# EAGLE design timerShield_r1 (EAGLE 9.6.2)
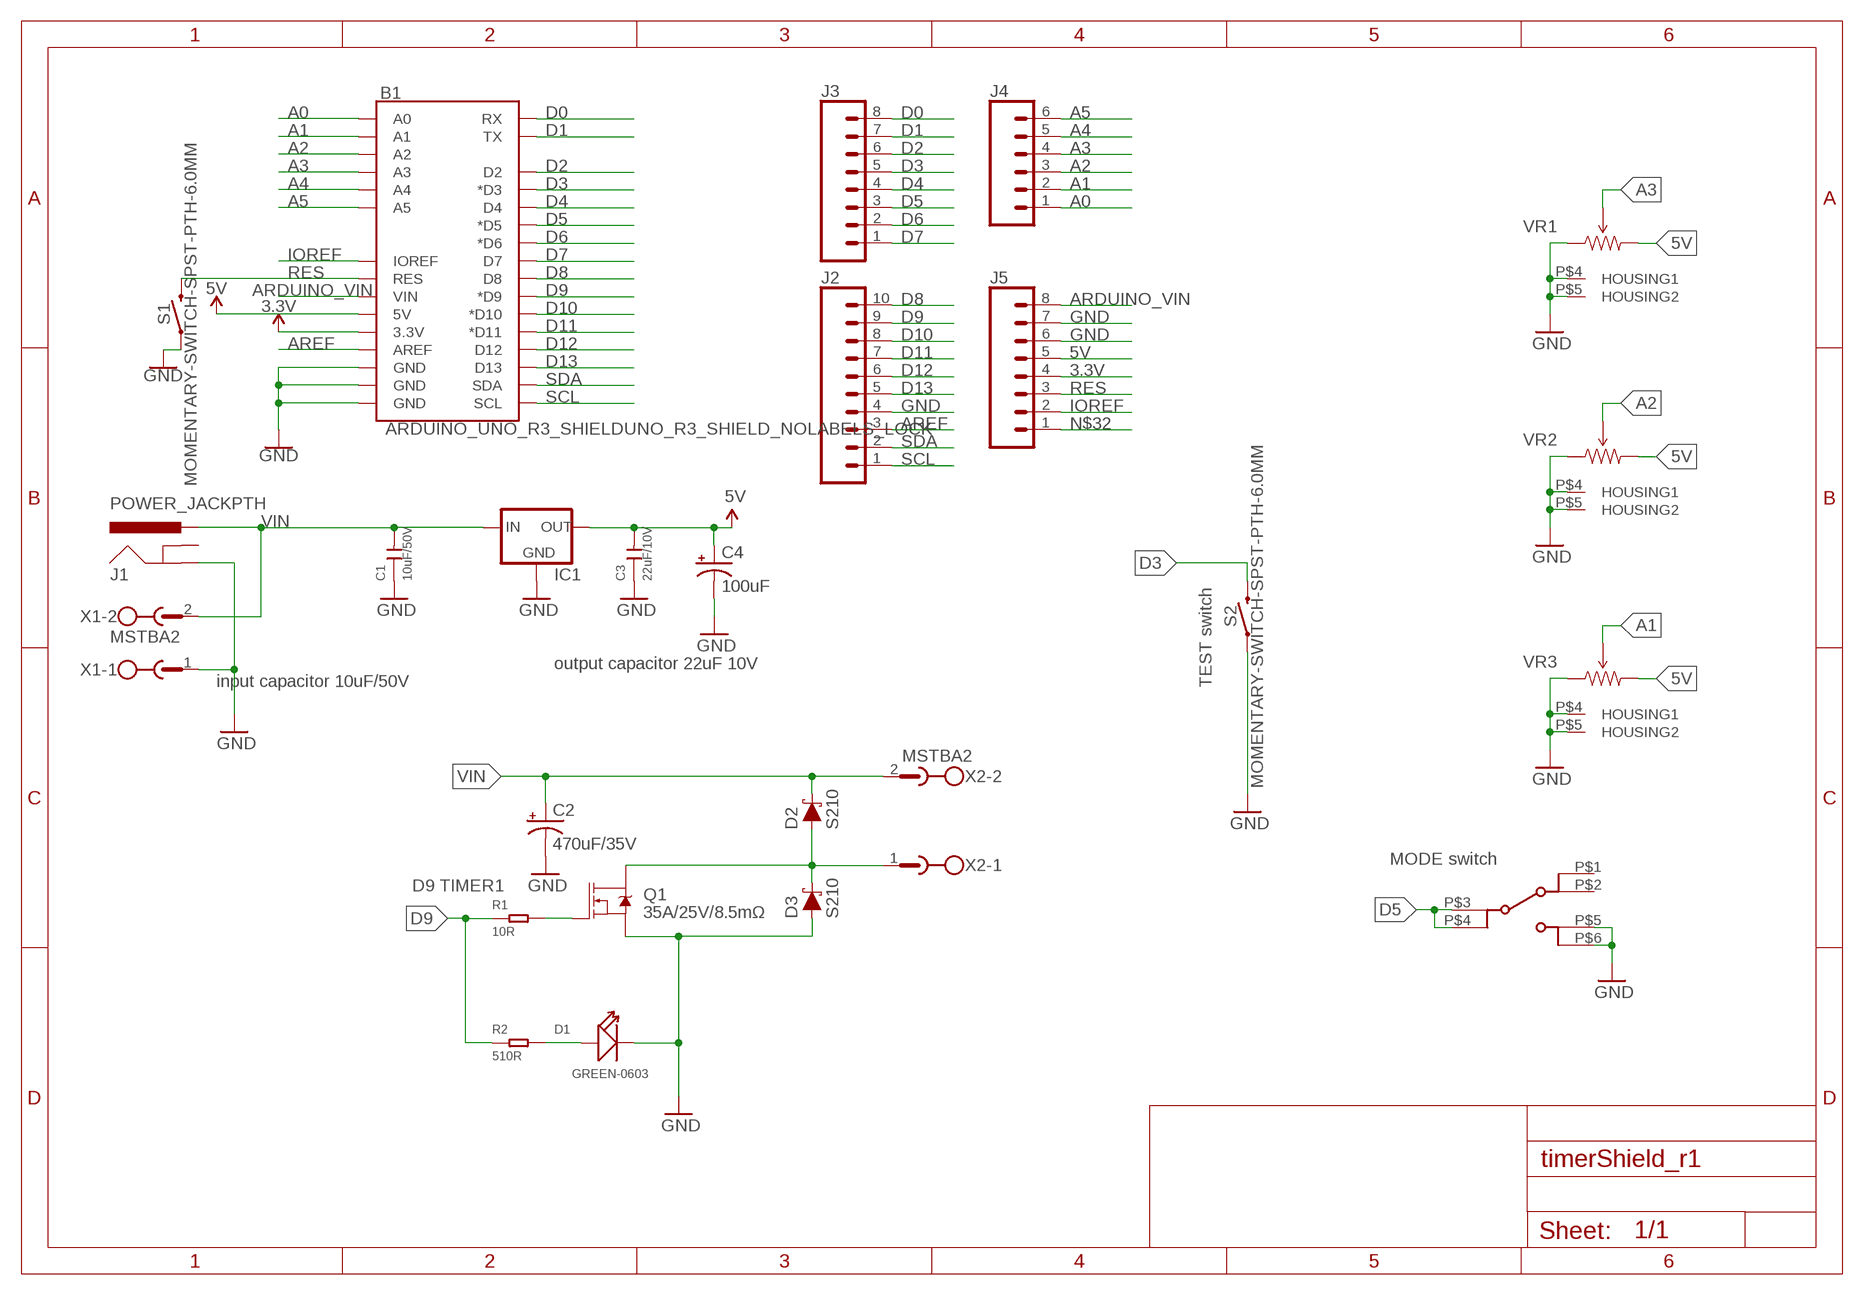
[diagram p0: schematic, sheet 1]

## Parts
B1  ARDUINO_UNO_R3_SHIELDUNO_R3_SHIELD_NOLABELS_LOCK  [UNO_R3_SHIELD_NOLABELS_LOCK]
C1  10uF/50V  CERAMIC-10UF-25V-10%-X5R(1206)  [C1206]
C2  470uF/35V  1000UF-RADIAL-5MM-35V-20%-KIT  [CPOL-RADIAL-5MM-10MM-KIT]
C3  22uF/10V  CERAMIC-22UF-6.3V-20%-X5R(0805)  [C0805]
C4  100uF  100UF-POLAR-RADIAL-2.5MM-25V-20%  [CPOL-RADIAL-2.5MM-6.5MM]
D1  GREEN-0603  SMD-LED-CLEAR-GREEN(0603)  [LED-0603]
D2  S210  DIODE-SCHOTTKY-B340A  [SMA-DIODE]
D3  S210  DIODE-SCHOTTKY-B340A  [SMA-DIODE]
IC1  V_REG_78XX_K78XX-500R3  [K78XX-500R3]
J1  POWER_JACKPTH  [POWER_JACK_PTH]
J2  CONN_10"  [1X10]
J3  CONN_08"  [1X08]
J4  CONN_06SILK_FEMALE_PTH  [1X06]
J5  CONN_08"  [1X08]
MODE  SW_SSSS213202NARROW  [SW-SSSS213202NARROW]
Q1  35A/25V/8.5mΩ  MOSFET-NCH-FDD8780  [DPAK]
R1  10R  SMD-RES-10R-5%-1/10W(0603)  [R0603]
R2  510R  SMD-RES-510R-5%-1/10W(0603)  [R0603]
S1  MOMENTARY-SWITCH-SPST-PTH-6.0MM  [TACTILE_SWITCH_PTH_6.0MM]
S2  MOMENTARY-SWITCH-SPST-PTH-6.0MM  [TACTILE_SWITCH_PTH_6.0MM]
VR1  TRIMVR_HOUSING_RK09  [RK09]
VR2  TRIMVR_HOUSING_RK09  [RK09]
VR3  TRIMVR_HOUSING_RK09  [RK09]
X1  MSTBA2  [MSTBA2]
X2  MSTBA2  [MSTBA2]

## Nets
3.3V: B1.3.3V J5.4
5V: B1.5V C3.2 C4.1(+) IC1.3(OUT) J5.5 VR1.3(CW) VR2.3(CW) VR3.3(CW)
A0: B1.A0 J4.1
A1: B1.A1 J4.2 VR3.2(WIPER)
A2: B1.A2 J4.3 VR2.2(WIPER)
A3: B1.A3 J4.4 VR1.2(WIPER)
A4: B1.A4 J4.5
A5: B1.A5 J4.6
ARDUINO_VIN: B1.VIN J5.8
AREF: B1.AREF J2.3
D0: B1.RX J3.8
D1: B1.TX J3.7
D2: B1.D2 J3.6
D3: B1.D3(*D3) J3.5 S2.3
D4: B1.D4 J3.4
D5: B1.D5(*D5) J3.3 MODE.P$3(2-1) MODE.P$4(2-2)
D6: B1.D6(*D6) J3.2
D7: B1.D7 J3.1
D8: B1.D8 J2.10
D9: B1.D9(*D9) J2.9 R1.1 R2.1
D10: B1.D10(*D10) J2.8
D11: B1.D11(*D11) J2.7
D12: B1.D12 J2.6
D13: B1.D13 J2.5
GND: B1.GND@0(GND) B1.GND@1(GND) B1.GND@2(GND) C1.1 C2.- C3.1 C4.2(-) D1.- D3.A IC1.2(GND) J1.GND J2.4 J5.6 J5.7 MODE.P$5(3-1) MODE.P$6(3-2) Q1.3(S) S1.1 S2.1 VR1.1(CCW) VR1.P$4(HOUSING1) VR1.P$5(HOUSING2) VR2.1(CCW) VR2.P$4(HOUSING1) VR2.P$5(HOUSING2) VR3.1(CCW) VR3.P$4(HOUSING1) VR3.P$5(HOUSING2) X1.1
IOREF: B1.IOREF J5.2
N$1: Q1.1(G) R1.2
N$2: D1.+ R2.2
N$4: D2.A D3.C Q1.4(D) X2.1
N$32: J5.1
RES: B1.RES J5.3 S1.3
SCL: B1.SCL J2.1
SDA: B1.SDA J2.2
VIN: C1.2 C2.+ D2.C IC1.1(IN) J1.PWR X1.2 X2.2
Unconnected: J1.GNDBREAK MODE.P$1(1-1) MODE.P$2(1-2)

## Notes on the sheet
- output capacitor 22uF 10V
- input capacitor 10uF/50V | TEST switch
- MODE switch
- D9 TIMER1

## Library data of the parts
B1 = SparkFun-Boards:ARDUINO_UNO_R3_SHIELD: Arduino R3 Shield Footprint Shield form compatible with the Arduino Uno R3. SparkFun Products: MG2639 Cellular Shield <https://www.sparkfun.com/products/13120> MIDI Shield <https://www.sparkfun.com/products/12898> R3 Stackable Headers Kit <https://www.sparkfun.com/products/11417>
C1 = Seeed-Capacitor:CERAMIC-10UF-25V-10%-X5R(1206): 302010181; MPN: CC1206KKX5R8BB106; VALUE: 10uf
C2 = SparkFun-Capacitors:1000UF: 1,000µF/1mF ceramic capacitors A capacitor is a passive two-terminal electrical component used to store electrical energy temporarily in an electric field. CAP-08070; PROD_ID: CAP-09538; VALUE: 1mf
C3 = Seeed-Capacitor:CERAMIC-22UF-6.3V-20%-X5R(0805): 302010171; MPN: CC0805MKX5R5BB226; VALUE: 22uf
C4 = SparkFun-Capacitors:100UF-POLAR: 100µF polarized capacitors A capacitor is a passive two-terminal electrical component used to store electrical energy temporarily in an electric field.; PROD_ID: CAP-08439
D1 = Seeed-LED:SMD-LED-CLEAR-GREEN(0603): 304090043; MPN: 19-217-G7C-AN1P2-3T
D2 D3 = SparkFun-DiscreteSemi:DIODE-SCHOTTKY: Schottky diode A Schottky diode is a semiconductor diode which has a low forward voltage drop and a very fast switching action.; PROD_ID: DIO-09886; VALUE: 3A/40V/500mV
IC1 = _kantaParts:V_REG_78XX: Voltage Regulator Standard 7805 5V regulator. IGO (Input Ground Output). Spark Fun Electronics SKU : COM-00107 V7805-1000 <http://akizukidenshi.com/catalog/g/gM-06350/>
J1 = SparkFun-Connectors:POWER_JACK: Power Jack This is the standard 5.5mm barrel jack for power. The PTH is the most common, proven, reliable, footprint. The Slot footprint only works if the mill layer is transmitted to the PCB fab house so be warned. Mating wall wart : TOL-00298 (and others); PROD_ID: CONN-08197
J2 = SparkFun-Connectors:CONN_10: Multi connection point. Often used as Generic Header-pin footprint for 0.1 inch spaced/style header connections On any of the 0.1 inch spaced packages, you can populate with these: Break Away Headers - Straight <https://www.sparkfun.com/products/116> (PRT-00116) Break Away Male Headers - Right Angle <https://www.sparkfun.com/products/553> (PRT-00553) Female Headers <https://www.sparkfun.com/products/115> (PRT-00115) Break Away Headers - Machine Pin <https://www.sparkfun.com/products/117> (PRT-00117) Break Away Female Headers - Swiss Machine Pin <https://www.sparkfun.com/products/743> (PRT-00743) Arduino Stackable Header - 10 Pin <https://www.sparkfun.com/products/11376> (PRT-11376) For SCREWTERMINALS and SPRING TERMINALS visit here: Screw Terimnals on SparkFun.com <https://www.sparkfun.com/search/results?term=Screw+Terminals> (5mm/3.5mm/2.54mm spacing) This device is also useful as a general connection point to wire up your design to another part of your project. Our various solder wires solder well into these plated through hole pads. Hook-Up Wire - Assortment (Stranded, 22 AWG) <https://www.sparkfun.com/products/11375> (PRT-11375) Hook-Up Wire - Assortment (Solid Core, 22 AWG) <https://www.sparkfun.com/products/11367> (PRT-11367) View the entire wire category on our website here <https://www.sparkfun.com/categories/141> Special notes: Molex polarized connector foot print use with SKU : PRT-08231 with associated crimp pins and housings. 1MM SMD Version SKU: PRT-10208 NOTES ON THE VARIANTS LOCK and LOCK_LONGPADS... This footprint was designed to help hold the alignment of a through-hole component (i.e. 6-pin header) while soldering it into place. You may notice that each hole has been shifted either up or down by 0.005 of an inch from it's more standard position (which is a perfectly straight line). This slight alteration caused the pins (the squares in the middle) to touch the edges of the holes. Because they are alternating, it causes a "brace" to hold the component in place. 0.005 has proven to be the perfect amount of "off-center" position when using our standard breakaway headers. Although looks a little odd when you look at the bare footprint, once you have a header in there, the alteration is very hard to notice. Also,if you push a header all the way into place, it is covered up entirely on the bottom side.; PROD_ID: CONN-11563
J3 J5 = SparkFun-Connectors:CONN_08: Multi connection point. Often used as Generic Header-pin footprint for 0.1 inch spaced/style header connections On any of the 0.1 inch spaced packages, you can populate with these: Break Away Headers - Straight <https://www.sparkfun.com/products/116> (PRT-00116) Break Away Male Headers - Right Angle <https://www.sparkfun.com/products/553> (PRT-00553) Female Headers <https://www.sparkfun.com/products/115> (PRT-00115) Break Away Headers - Machine Pin <https://www.sparkfun.com/products/117> (PRT-00117) Break Away Female Headers - Swiss Machine Pin <https://www.sparkfun.com/products/743> (PRT-00743) Arduino Stackable Header - 8 Pin <https://www.sparkfun.com/products/9279> (PRT-09279) For SCREWTERMINALS and SPRING TERMINALS visit here: Screw Terimnals on SparkFun.com <https://www.sparkfun.com/search/results?term=Screw+Terminals> (5mm/3.5mm/2.54mm spacing) This device is also useful as a general connection point to wire up your design to another part of your project. Our various solder wires solder well into these plated through hole pads. Hook-Up Wire - Assortment (Stranded, 22 AWG) <https://www.sparkfun.com/products/11375> (PRT-11375) Hook-Up Wire - Assortment (Solid Core, 22 AWG) <https://www.sparkfun.com/products/11367> (PRT-11367) View the entire wire category on our website here <https://www.sparkfun.com/categories/141> Special notes: Molex polarized connector foot print use with SKU : PRT-08231 with associated crimp pins and housings. 1MM SMD Version SKU: PRT-10208 NOTES ON THE VARIANTS LOCK and LOCK_LONGPADS... This footprint was designed to help hold the alignment of a through-hole component (i.e. 6-pin header) while soldering it into place. You may notice that each hole has been shifted either up or down by 0.005 of an inch from it's more standard position (which is a perfectly straight line). This slight alteration caused the pins (the squares in the middle) to touch the edges of the holes. Because they are alternating, it causes a "brace" to hold the component in place. 0.005 has proven to be the perfect amount of "off-center" position when using our standard breakaway headers. Although looks a little odd when you look at the bare footprint, once you have a header in there, the alteration is very hard to notice. Also,if you push a header all the way into place, it is covered up entirely on the bottom side.; PROD_ID: CONN-08438
J4 = SparkFun-Connectors:CONN_06: Multi connection point. Often used as Generic Header-pin footprint for 0.1 inch spaced/style header connections On any of the 0.1 inch spaced packages, you can populate with these: Break Away Headers - Straight <https://www.sparkfun.com/products/116> (PRT-00116) Break Away Male Headers - Right Angle <https://www.sparkfun.com/products/553> (PRT-00553) Female Headers <https://www.sparkfun.com/products/115> (PRT-00115) Break Away Headers - Machine Pin <https://www.sparkfun.com/products/117> (PRT-00117) Break Away Female Headers - Swiss Machine Pin <https://www.sparkfun.com/products/743> (PRT-00743) Arduino Stackable Header - 6 Pin <https://www.sparkfun.com/products/9280> (PRT-09280) For SCREWTERMINALS and SPRING TERMINALS visit here: Screw Terimnals on SparkFun.com <https://www.sparkfun.com/search/results?term=Screw+Terminals> (5mm/3.5mm/2.54mm spacing) This device is also useful as a general connection point to wire up your design to another part of your project. Our various solder wires solder well into these plated through hole pads. Hook-Up Wire - Assortment (Stranded, 22 AWG) <https://www.sparkfun.com/products/11375> (PRT-11375) Hook-Up Wire - Assortment (Solid Core, 22 AWG) <https://www.sparkfun.com/products/11367> (PRT-11367) View the entire wire category on our website here <https://www.sparkfun.com/categories/141>; PROD_ID: CONN-08437
MODE = _kantaParts:SW_SSSS213202: Slide Switch SMT ALPS SSSS213202 Akiduki : P-05043 <http://akizukidenshi.com/catalog/g/gP-05043/> Datasheet : http://www.alps.com/WebObjects/catalog.woa/J/HTML/Switch/Slide/SSSS2/SSSS213202.html
Q1 = SparkFun-DiscreteSemi:MOSFET-NCH: N-channel MOSFETs Voltage controlled devices that allow control of high current outputs. SparkFun Products: SparkFun OpenScale <https://www.sparkfun.com/products/13261> SparkFun Digital Sandbox <https://www.sparkfun.com/products/12651> SparkFun Monster Moto Shield <https://www.sparkfun.com/products/10182> SparkFun MOSFET Power Controller <https://www.sparkfun.com/products/11214>; PROD_ID: TRANS-09984
R1 = OPL_Resistor:SMD-RES-10R-5%-1/10W(0603): 301010096; MPN: RC0603JR-0710RL
R2 = OPL_Resistor:SMD-RES-510R-5%-1/10W(0603): 301012134; MPN: RC0603JR-07510RL
S1 S2 = SparkFun-Switches:MOMENTARY-SWITCH-SPST: Momentary Switch (Pushbutton) - SPST Normally-open (NO) SPST momentary switches (buttons, pushbuttons). Variants PTH-12MM - 12mm square, through-hole Momentary Pushbutton Switch - 12mm Square <https://www.sparkfun.com/products/9190> (COM-09190) PTH-6.0MM, PTH-6.0MM-KIT - 6.0mm square, through-hole Mini Pushbutton Switch <https://www.sparkfun.com/products/97> (COM-00097) KIT package intended for soldering kit's - only one side of pads' copper is exposed. PTH-RIGHT-ANGLE-KIT - Right-angle, through-hole Right Angle Tactile Button <https://www.sparkfun.com/products/10791> - Used on SparkFun BigTime Watch Kit <https://www.sparkfun.com/products/11734> SMD-12MM - 12mm square, surface-mount Tactile Button - SMD (12mm) <https://www.sparkfun.com/products/12993> (COM-12993) Used on SparkFun PicoBoard <https://www.sparkfun.com/products/11888> SMD-4.5MM - 4.5mm Square Trackball Switch Used on SparkFun Blackberry Trackballer Breakout <https://www.sparkfun.com/products/13169> SMD-4.6MMX2.8MM - 4.60mm x 2.80mm, surface mount Used on SparkFun SAMD21 Mini Breakout <https://www.sparkfun.com/products/13664> SMD-5.2MM, SMD-5.2-REDUNDANT - 5.2mm square, surface-mount Mini Pushbutton Switch - SMD <https://www.sparkfun.com/products/8720> (COM-08720) Used on Arduino Pro Mini <https://www.sparkfun.com/products/11114> REDUNDANT package connects both switch circuits together SMD-6.0X3.5MM - 6.0 x 3.5mm, surface mount Momentary Reset Switch SMD <https://www.sparkfun.com/products/8229> (COM-08229) SMD-6.2MM-TALL - 6.2mm square, surface mount Tactile Button - SMD (6mm) <https://www.sparkfun.com/products/12992> Used on SparkFun Digital Sandbox <https://www.sparkfun.com/products/12651> SMD-RIGHT-ANGLE - Right-angle, surface mount Used on SparkFun Block for Intel® Edison - Arduino <https://www.sparkfun.com/products/13036>; PROD_ID: SWCH-08441; SF_SKU: COM-00097
VR1-VR3 = _kantaParts:TRIMVR_HOUSING: Trimmer VR with housing terminal RK09 ALPS without center click : RS 154-8162 <https://jp.rs-online.com/web/p/potentiometers/1548162/> with center click : RS 729-3603 <https://jp.rs-online.com/web/p/potentiometers/7293603/>
X1 X2 = con-phoenix-508:MSTBA2: PHOENIX; MF: FARNELL; MPN: 1757242; OC_FARNELL: 3705171; OC_NEWARK: 71C4161

## Net classes
1 Power: width 0.305 mm, clearance 0.178 mm

## Board
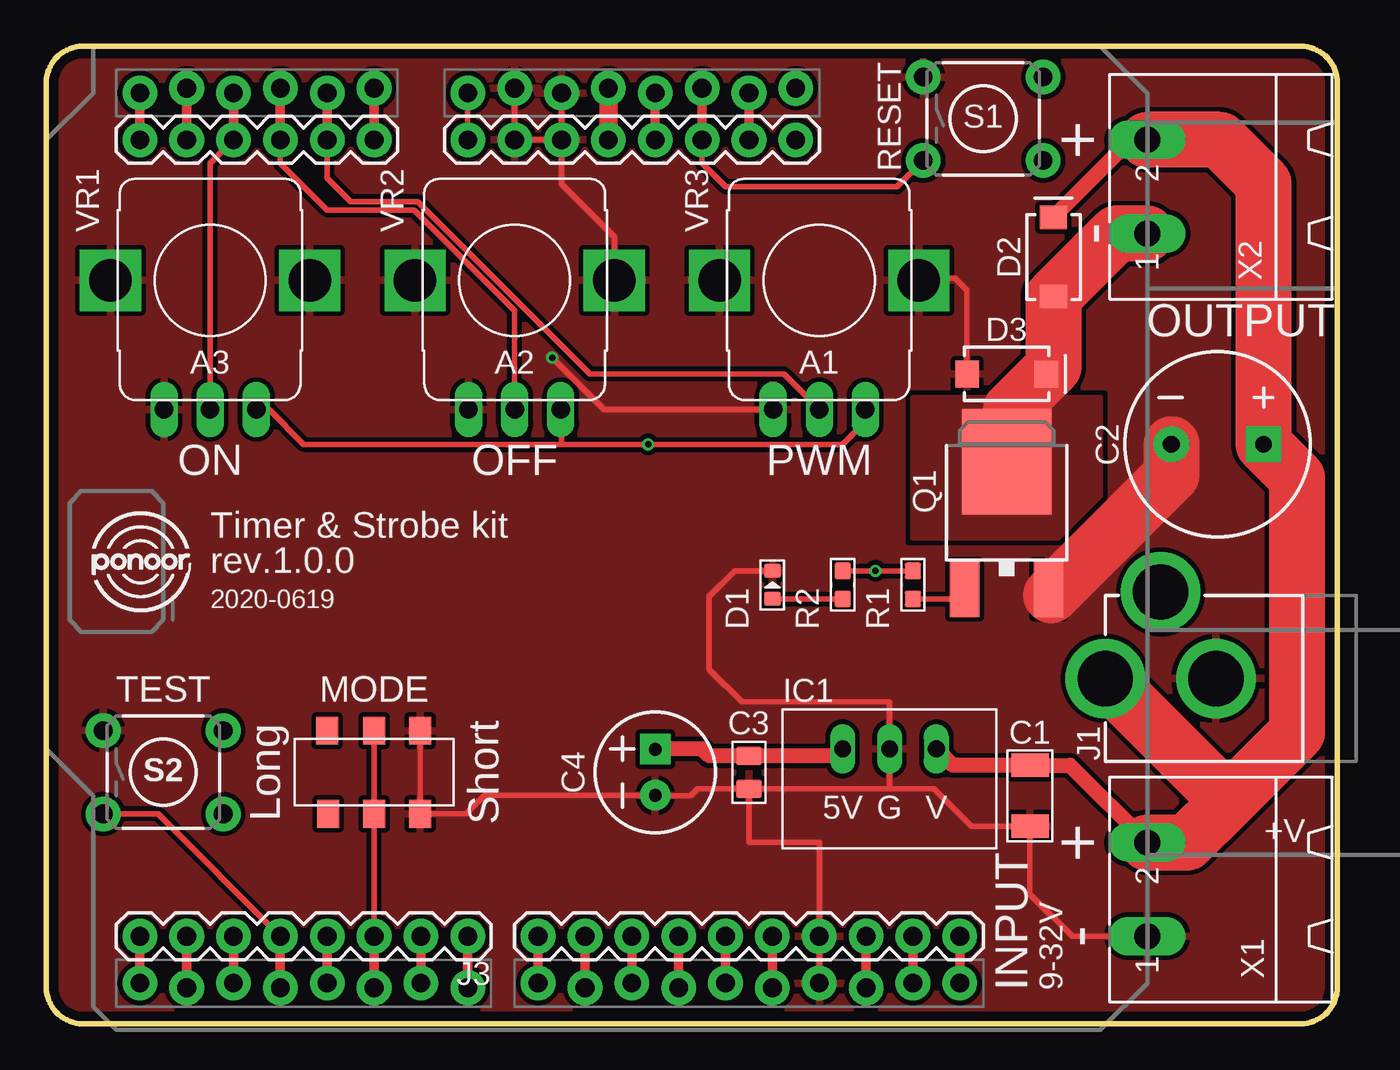
[diagram p1: board, top side]
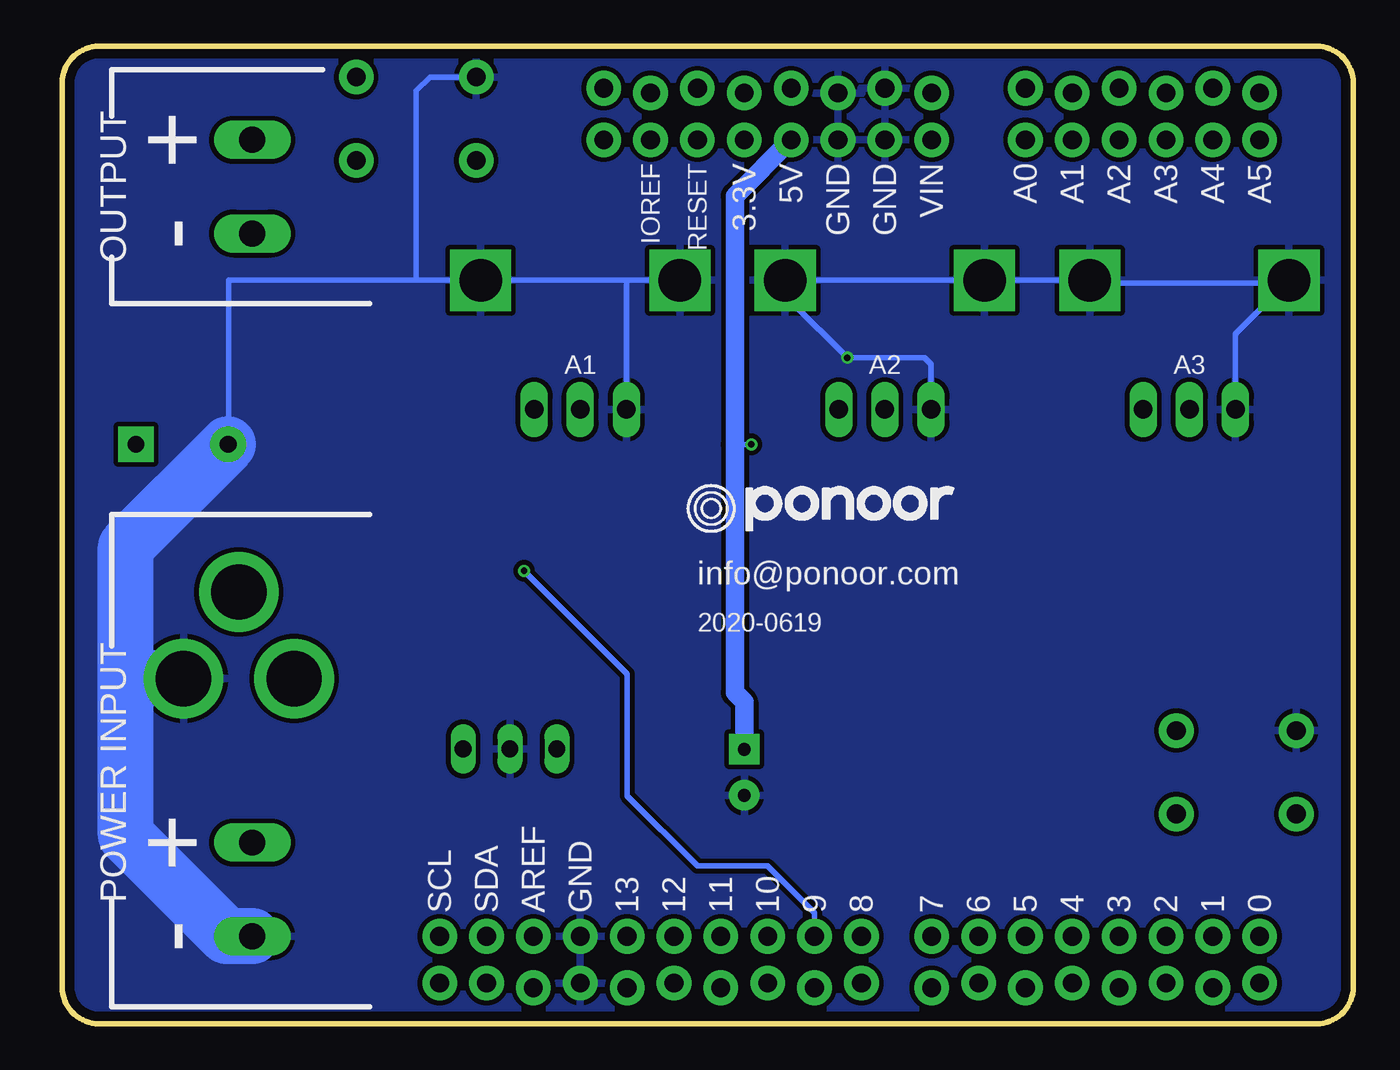
[diagram p2: board, bottom side, seen from below]

Size 70 x 53 mm. Coordinates in mm from the lower left corner, seen from the top.
Outline: 0,51 arc-90 2,53 68,53 arc-90 70,51 70,2 arc-90 68,0 2,0 arc-90 0,2 0,51
Copper layers (1*16): Top 0.035mm / dielectric 1.6mm / Bottom 0.035mm
Design rules "PcbGoGo_2-layer_PCB_eagle_rule": minimum track width 6mil, minimum drill 12mil, track to track 6mil, track to pad 6mil, pad to pad 6mil, via to via 8mil, smd to smd 0mil, copper to edge 20mil, drill to drill 10mil, minimum pad ring 6mil, minimum via ring 6mil, stop-mask expansion 0mil, vias tented up to drill 100mil, thermal gap 10mil

### Footprints (pad centres in the part's own frame; a part is rotated, then mirrored left to right if it is on the bottom)
UNO_R3_SHIELD_NOLABELS_LOCK = drill 1.016 pad 1.88: 3.3V 24.13,-3.81; 5V 24.384,-1.27; A0 24.384,11.43; A1 24.13,13.97; A2 24.384,16.51; A3 24.13,19.05; A4 24.384,21.59; A5 24.13,24.13; AREF -24.384,-15.24; D2 -24.13,19.05; D3 -24.384,16.51; D4 -24.13,13.97; D5 -24.384,11.43; D6 -24.13,8.89; D7 -24.384,6.35; D8 -24.13,2.54; D9 -24.384,0; D10 -24.13,-2.54; D11 -24.384,-5.08; D12 -24.13,-7.62; D13 -24.384,-10.16; GND@0 24.13,1.27; GND@1 24.384,3.81; GND@2 -24.13,-12.7; IOREF 24.13,-8.89; NC 24.384,-11.43; RES 24.384,-6.35; RX -24.13,24.13; SCL -24.13,-20.32; SDA -24.13,-17.78; TX -24.384,21.59; VIN 24.13,6.35
C1206 = smd 1.27 x 2.032: 1 -1.651,0; 2 1.651,0
CPOL-RADIAL-5MM-10MM-KIT = drill 0.9 pad 1.93 square: + 2.5,0 | drill 0.9 pad 1.93: - -2.5,0
C0805 = smd 1.397 x 1.016: 1 0,0.889; 2 0,-0.889
CPOL-RADIAL-2.5MM-6.5MM = drill 0.7 pad 1.651 square: 1 1.25,0 | drill 0.7 pad 1.651: 2 -1.25,0
LED-0603 = smd 0.762 x 0.889: + -0.762,0; - 0.762,0
SMA-DIODE = smd 1.27 x 1.47: A -2.15,0; C 2.15,0
K78XX-500R3 = drill 0.9 long: 1 -2.54,0; 2 0,0; 3 2.54,0
POWER_JACK_PTH = drill 2.997 pad 4.318: GND 0,7.7; GNDBREAK 4.7,10.7; PWR 0,13.7
1X10 = drill 1.016 pad 1.88: 1 0,0; 2 2.54,0; 3 5.08,0; 4 7.62,0; 5 10.16,0; 6 12.7,0; 7 15.24,0; 8 17.78,0; 9 20.32,0; 10 22.86,0
1X08 = drill 1.016 pad 1.88: 1 0,0; 2 2.54,0; 3 5.08,0; 4 7.62,0; 5 10.16,0; 6 12.7,0; 7 15.24,0; 8 17.78,0
1X06 = drill 1.016 pad 1.88: 1 0,0; 2 2.54,0; 3 5.08,0; 4 7.62,0; 5 10.16,0; 6 12.7,0
SW-SSSS213202NARROW = smd 1.2 x 1.5: P$1 -2.55,2.25; P$2 -2.5,-2.25; P$3 0,2.25; P$4 0,-2.25; P$5 2.5,2.25; P$6 2.5,-2.25
DPAK = smd 1.6 x 3: 1 -2.28,-5.31; 3 2.28,-5.31 | smd 4.826 x 5.715: 4 0,1.588
R0603 = smd 0.889 x 0.889: 1 0,0.762; 2 0,-0.762
TACTILE_SWITCH_PTH_6.0MM = drill 1.016 pad 1.88: 1 -3.251,2.261; 2 3.251,2.261; 3 -3.251,-2.261; 4 3.251,-2.261
RK09 = drill 1 long: 1 -2.5,-7; 2 0,-7; 3 2.5,-7 | drill 2.3 square: P$4 -5.4,0; P$5 5.4,0
MSTBA2 = drill 1.397 long: 1 -2.54,5.08; 2 2.54,5.08

### Placement (x,y rotation side)
B1  29.21,26.33 90 top
C1  53.34,12.36 90 top
C2  63.5,31.41 0 top
C3  38.1,13.63 180 top
C4  33.02,13.63 90 top
D1  39.37,23.79 90 top
D2  54.61,41.57 90 top
D3  52.07,35.22 0 top
IC1  45.72,14.9 180 top
J1  71.12,18.71 90 top
J2  49.53,4.74 180 top
J3  22.86,4.74 180 top
J4  17.78,47.92 180 top
J5  40.64,47.92 180 top
MODE  17.78,13.63 0 top
Q1  52.07,28.87 0 top
R1  46.99,23.79 0 top
R2  43.18,23.79 0 top
S1  50.8,49.06 0 top
S2  6.35,13.63 0 top
U$1  [PONOOR_LOGO_6MM]  5.08,25.06 0 top
U$2  [PONOOR_TEXT_15MM]  36.83,26.33 0 bottom
VR1  8.89,40.3 0 top
VR2  25.4,40.3 0 top
VR3  41.91,40.3 0 top
X1  64.77,7.28 90 top
X2  64.77,45.38 90 top

### Tracks (layer width: path | path; a pad name or v marks a point on that pad's centre or on a via)
3.3V
  Top 0.508: B1.3.3V J5.4
5V  (via drill 0.35)
  Top 0.305: VR1.3 12.08,33.3 13.97,31.41 27.94,31.41 | 27.94,31.41 v32.64,31.41 43.18,31.41 44.41,32.64 VR3.3 | VR2.3 27.94,33.26 27.94,31.41
  Top 0.813: IC1.3 42.8,14.52 C3.2 35.94,14.52 35.56,14.9 33.04,14.9 C4.1
  Top 1.016: B1.5V J5.5
  Bottom 0.305: 33.53,31.41 v32.64,31.41
  Bottom 1.016: J5.5 33.53,44.87 33.53,31.41 33.53,17.95 33.02,17.44 C4.1
A0
  Top 0.508: J4.1 B1.A0
A1
  Top 0.305: VR3.2 39.99,35.22 29.47,35.22 20.13,44.57 16.51,44.57 15.24,45.84 J4.2
  Top 0.508: B1.A1 J4.2
A2
  Top 0.305: J4.3 12.7,46.65 15.24,44.11 19.94,44.11 25.4,38.65 VR2.2
  Top 0.508: B1.A2 J4.3
A3
  Top 0.305: VR1.2 8.89,46.65 J4.4
  Top 0.508: B1.A3 J4.4
A4
  Top 0.508: B1.A4 J4.5
A5
  Top 0.508: B1.A5 J4.6
ARDUINO_VIN
  Top 0.305: B1.VIN J5.8
AREF
  Top 0.508: B1.AREF J2.3
D0
  Top 0.508: J3.8 B1.RX
D1
  Top 0.508: B1.TX J3.7
D2
  Top 0.508: J3.6 B1.D2
D3
  Top 0.305: S2.3 6.07,11.37 J3.5
  Top 0.508: J3.5 B1.D3
D4
  Top 0.508: J3.4 B1.D4
D5
  Top 0.305: J3.3 MODE.P$4 MODE.P$3
  Top 0.508: J3.3 B1.D5
D6
  Top 0.508: J3.2 B1.D6
D7
  Top 0.508: J3.1 B1.D7
D8
  Top 0.508: J2.10 B1.D8
D9  (via drill 0.35)
  Top 0.305: R1.1 v44.96,24.55 R2.1
  Top 0.508: J2.9 B1.D9
  Bottom 0.305: v44.96,24.55 39.37,18.96 39.37,12.36 35.56,8.55 31.75,8.55 29.21,6.01 J2.9
D10
  Top 0.508: B1.D10 J2.8
D11
  Top 0.508: J2.7 B1.D11
D12
  Top 0.508: B1.D12 J2.6
D13
  Top 0.508: J2.5 B1.D13
GND  (via drill 0.35)
  Top 0.305: Q1.3 54.48,23.43 54.48,23.24 | MODE.P$5 MODE.P$6 22.77,11.38 23.77,12.38 C4.2 33.04,12.36 34.92,12.36 35.31,12.74 C3.1 | VR3.1 30.24,33.3 v27.43,36.11 | D3.A 49.92,39.78 49.28,40.43 47.44,40.43 VR3.P$5 | D1.- 37.34,24.55 35.94,23.16 35.94,19.22 37.72,17.44 45.72,17.44 IC1.2 45.72,12.74 | C3.1 45.72,12.74 | 45.72,12.74 48.13,12.74 50.16,10.71 C1.1 53.34,7.03 55.63,4.74 X1.1 | B1.GND@2 J2.4 41.91,9.82 38.1,9.82 C3.1 | B1.GND@1 J5.7 J5.6 | B1.GND@0 J5.6 | J5.6 27.94,45.51 30.8,42.65 VR2.P$5
  Top 3.048: C2.- 61,29.76 54.48,23.24
  Bottom 0.305: VR2.1 22.9,35.77 23.24,36.11 v27.43,36.11 30.48,39.16 30.48,40.3 | VR1.P$4 3.65,40.14 | 3.65,40.14 6.39,37.4 VR1.1 | 3.65,40.14 14.13,40.14 VR1.P$5 VR2.P$4 30.48,40.3 | 30.48,40.3 VR2.P$5 | VR3.1 39.41,40.26 | 39.41,40.26 39.37,40.3 VR3.P$4 | 39.41,40.26 39.45,40.3 VR3.P$5 50.8,40.3 | C2.- 60.96,31.45 60.96,40.3 50.8,40.3 | S1.1 50.06,51.32 50.8,50.59 50.8,40.3
  Bottom 3.048: X1.1 61.09,4.74 66.55,10.2 66.55,18.71 | C2.- 66.55,25.86 66.55,18.71 | J1.GND 66.55,18.71
  pour Top (isolate 0.254, rank 6): 0,53 70,53 70,0 0,0
  pour Bottom (isolate 0.254, rank 6): 0,53 70,53 70,0 0,0
IOREF
  Top 0.508: B1.IOREF J5.2
N$1
  Top 0.305: R1.2 49.26,23.03 Q1.1
N$2
  Top 0.305: D1.+ R2.2
N$4
  Top 3.048: X2.1 58.03,42.84 D2.A 54.61,35.61 D3.C 52.32,33.32 52.32,29.25 52.07,29.5 Q1.4
  pour Top (isolate 0.254, rank 2, no thermals): 57.15,33.95 57.15,26.33 46.99,26.33 46.99,33.95
RES
  Top 0.305: S1.3 46.13,45.38 36.83,45.38 35.56,46.65 35.56,49.19
  Top 0.508: B1.RES 35.56,49.19 J5.3
SCL
  Top 0.508: J2.1 B1.SCL
SDA
  Top 0.508: J2.2 B1.SDA
VIN
  Top 0.813: X2.2 58.81,47.92 D2.C | IC1.1 49.15,14.01 C1.2 55.5,14.01 X1.2
  Top 3.048: X1.2 61.85,9.82 64.01,11.98 | 64.01,11.98 67.82,15.79 67.82,29.59 C2.+ 66,45.55 63.63,47.92 X2.2 | J1.PWR 64.01,12.12 64.01,11.98

### Text on the board
tPlace: RESET | + | - | OUTPUT | A3 | A2 | A1 | ON | OFF | PWM | Timer & Strobe kit | rev.1.0.0 | 2020-0619 | TEST | Long | Short | 5V | G | V | + | +V | - | INPUT | 9-32V
bPlace: + | A5 | A4 | A3 | A2 | A1 | A0 | VIN | GND | GND | 5V | 3.3V | RESET | IOREF | OUTPUT | - | A3 | A2 | A1 | info@ponoor.com | 2020-0619 | POWER INPUT | + | 0 | 1 | 2 | 3 | 4 | 5 | 6 | 7 | 8 | 9 | 10 | 11 | 12 | 13 | GND | AREF | SDA | SCL | -